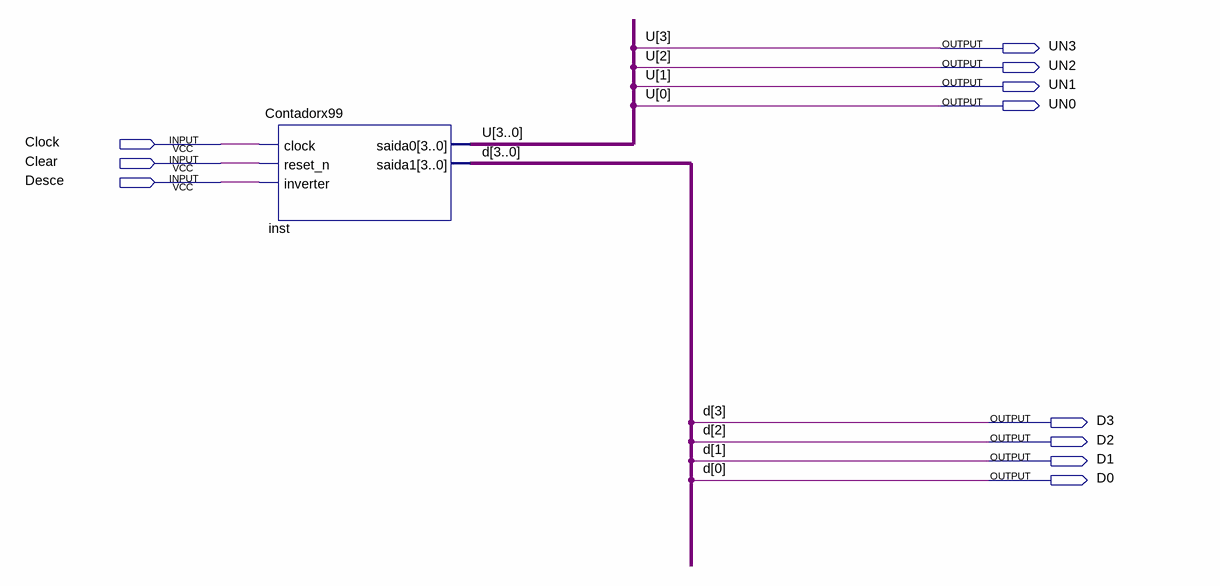
[diagram p0: schematic sheet]
// Quartus schematic PontoVolei.bdf as structural Verilog: 1 symbols, 11 pins
module PontoVolei (
  input  Clock,
  input  Clear,
  input  Desce,
  output UN3,
  output UN2,
  output UN1,
  output UN0,
  output D3,
  output D2,
  output D1,
  output D0
);

  Contadorx99 inst (
    .clock(Clock), .reset_n(Clear), .inverter(Desce), .saida0({UN3, UN2, UN1, UN0}), .saida1({D3, D2, D1, D0}));

  // Other names for the same wires on the sheet: U[3:0] = {UN3, UN2, UN1, UN0}
endmodule
